# EAGLE design untitled (EAGLE 6.5.0)
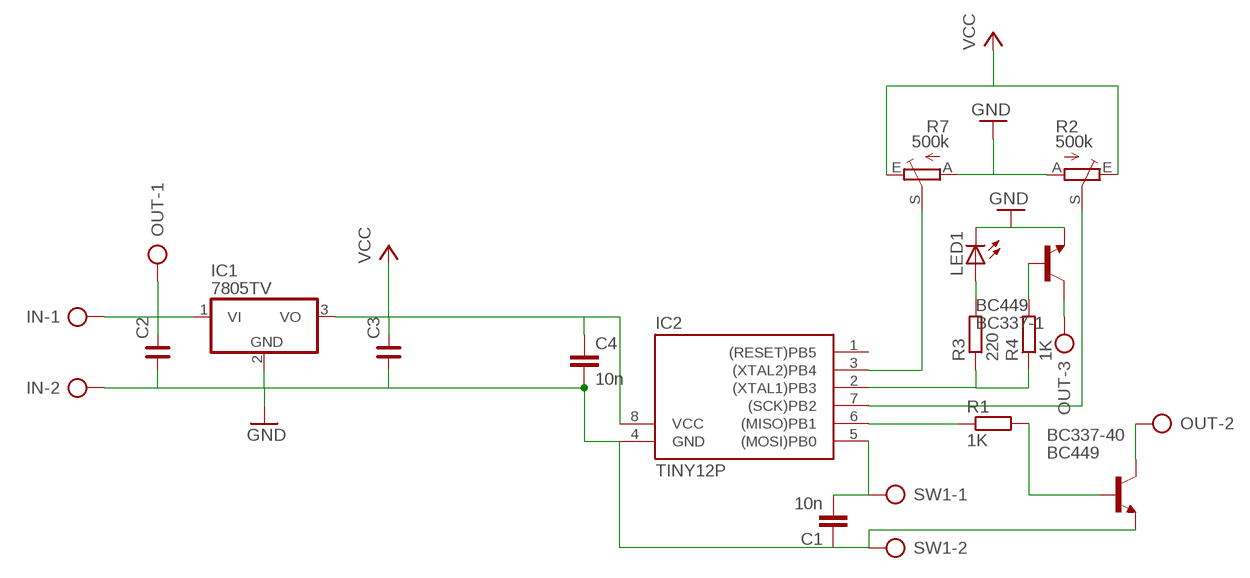
[diagram p0: schematic, sheet 1]

## Parts
BC337-1  BC449  [TO92-EBC]
BC337-40  BC449  [TO92-EBC]
C1  10n  C-EU050-024X044  [C050-024X044]
C2  C_1206  [C1206]
C3  C_1206  [C1206]
C4  10n  C-EU050-024X044  [C050-024X044]
IC1  7805TV  [TO220V]
IC2  TINY12P  [DIL08]
IN  AK500/2  [AK500/2]
LED1  LED3MM  [LED3MM]
OUT  AK500/3  [AK500/3]
R1  1K  R-EU_M1206  [M1206]
R2  500k  TRIM_EU-CA6V  [CA6V]
R3  220  R-EU_M1206  [M1206]
R4  1K  R-EU_M1206  [M1206]
R7  500k  TRIM_EU-CA6V  [CA6V]
SW1  AK500/2  [AK500/2]

## Nets
GND: BC337-1.E BC337-40.E C1.1 C2.1 C3.1 C4.2 IC1.2(GND) IC2.4(GND) IN.2 LED1.K(C) R2.A R7.A SW1.2
N$1: BC337-1.B R4.2
N$2: C2.2 IC1.1(VI) IN.1 OUT.1
N$3: BC337-40.C OUT.2
N$4: C1.2 IC2.5((MOSI)PB0) SW1.1
N$5: BC337-1.C OUT.3
N$6: IC2.6((MISO)PB1) R1.1
N$7: BC337-40.B R1.2
N$10: IC2.7((SCK)PB2) R2.S
N$11: IC2.3((XTAL2)PB4) R7.S
N$13: LED1.A R3.2
N$14: IC2.2((XTAL1)PB3) R3.1 R4.1
VCC: C3.2 C4.1 IC1.3(VO) IC2.8(VCC) R2.E R7.E
Unconnected: IC2.1((RESET)PB5)

## Library data of the parts
BC337-1 BC337-40 = transistor-npn:BC449*: NPN Transistor
C1 C4 = rcl:C-EU: CAPACITOR, European symbol
C2 C3 = rc-master:C_: NON-POLARIZED CAP
IC1 = linear:78*: Positive VOLTAGE REGULATOR Source: http://cache.national.com/ds/LM/LM78L05.pdf http://www.fairchildsemi.com/ds/LM/LM7805.pdf
IC2 = atmel:TINY12*: MICROCONTROLLER 1 Kbytes FLASH 64 bytes EEPROM; OC_FARNELL: unknown; OC_NEWARK: unknown
IN SW1 = con-ptr500:AK500/2: CONNECTOR; OC_FARNELL: unknown; OC_NEWARK: unknown
LED1 = led:LED: LED OSRAM: - CHIPLED LG R971, LG N971, LY N971, LG Q971, LY Q971, LO R971, LY R971 LH N974, LH R974 LS Q976, LO Q976, LY Q976 LO Q996 - Hyper CHIPLED LW Q18S LB Q993, LB Q99A, LB R99A - SideLED LS A670, LO A670, LY A670, LG A670, LP A670 LB A673, LV A673, LT A673, LW A673 LH A674 LY A675 LS A676, LA A676, LO A676, LY A676, LW A676 LS A679, LY A679, LG A679 - Hyper Micro SIDELED® LS Y876, LA Y876, LO Y876, LY Y876 LT Y87S - SmartLED LW L88C, LW L88S LB L89C, LB L89S, LG L890 LS L89K, LO L89K, LY L89K LS L896, LA L896, LO L896, LY L896 - TOPLED LS T670, LO T670, LY T670, LG T670, LP T670 LSG T670, LSP T670, LSY T670, LOP T670, LYG T670 LG T671, LOG T671, LSG T671 LB T673, LV T673, LT T673, LW T673 LH T674 LS T676, LA T676, LO T676, LY T676, LB T676, LH T676, LSB T676, LW T676 LB T67C, LV T67C, LT T67C, LS T67K, LO T67K, LY T67K, LW E67C LS E67B, LA E67B, LO E67B, LY E67B, LB E67C, LV E67C, LT E67C LW T67C LS T679, LY T679, LG T679 LS T770, LO T770, LY T770, LG T770, LP T770 LB T773, LV T773, LT T773, LW T773 LH T774 LS E675, LA E675, LY E675, LS T675 LS T776, LA T776, LO T776, LY T776, LB T776 LHGB T686 LT T68C, LB T68C - Hyper Mini TOPLED® LB M676 - Mini TOPLED Santana® LG M470 LS M47K, LO M47K, LY M47K Source: http://www.osram.convergy.de LUXEON: - LUMILED® LXK2-PW12-R00, LXK2-PW12-S00, LXK2-PW14-U00, LXK2-PW14-V00 LXK2-PM12-R00, LXK2-PM12-S00, LXK2-PM14-U00 LXK2-PE12-Q00, LXK2-PE12-R00, LXK2-PE12-S00, LXK2-PE14-T00, LXK2-PE14-U00 LXK2-PB12-K00, LXK2-PB12-L00, LXK2-PB12-M00, LXK2-PB14-N00, LXK2-PB14-P00, LXK2-PB14-Q00 LXK2-PR12-L00, LXK2-PR12-M00, LXK2-PR14-Q00, LXK2-PR14-R00 LXK2-PD12-Q00, LXK2-PD12-R00, LXK2-PD12-S00 LXK2-PH12-R00, LXK2-PH12-S00 LXK2-PL12-P00, LXK2-PL12-Q00, LXK2-PL12-R00 Source: www.luxeon.com KINGBRIGHT: KA-3528ASYC Source: www.kingbright.com
OUT = con-ptr500:AK500/3: CONNECTOR; OC_FARNELL: unknown; OC_NEWARK: unknown
R1 R3 R4 = resistor:R-EU_: RESISTOR, European symbol
R2 R7 = pot:TRIM_EU-: POTENTIOMETER

## Board
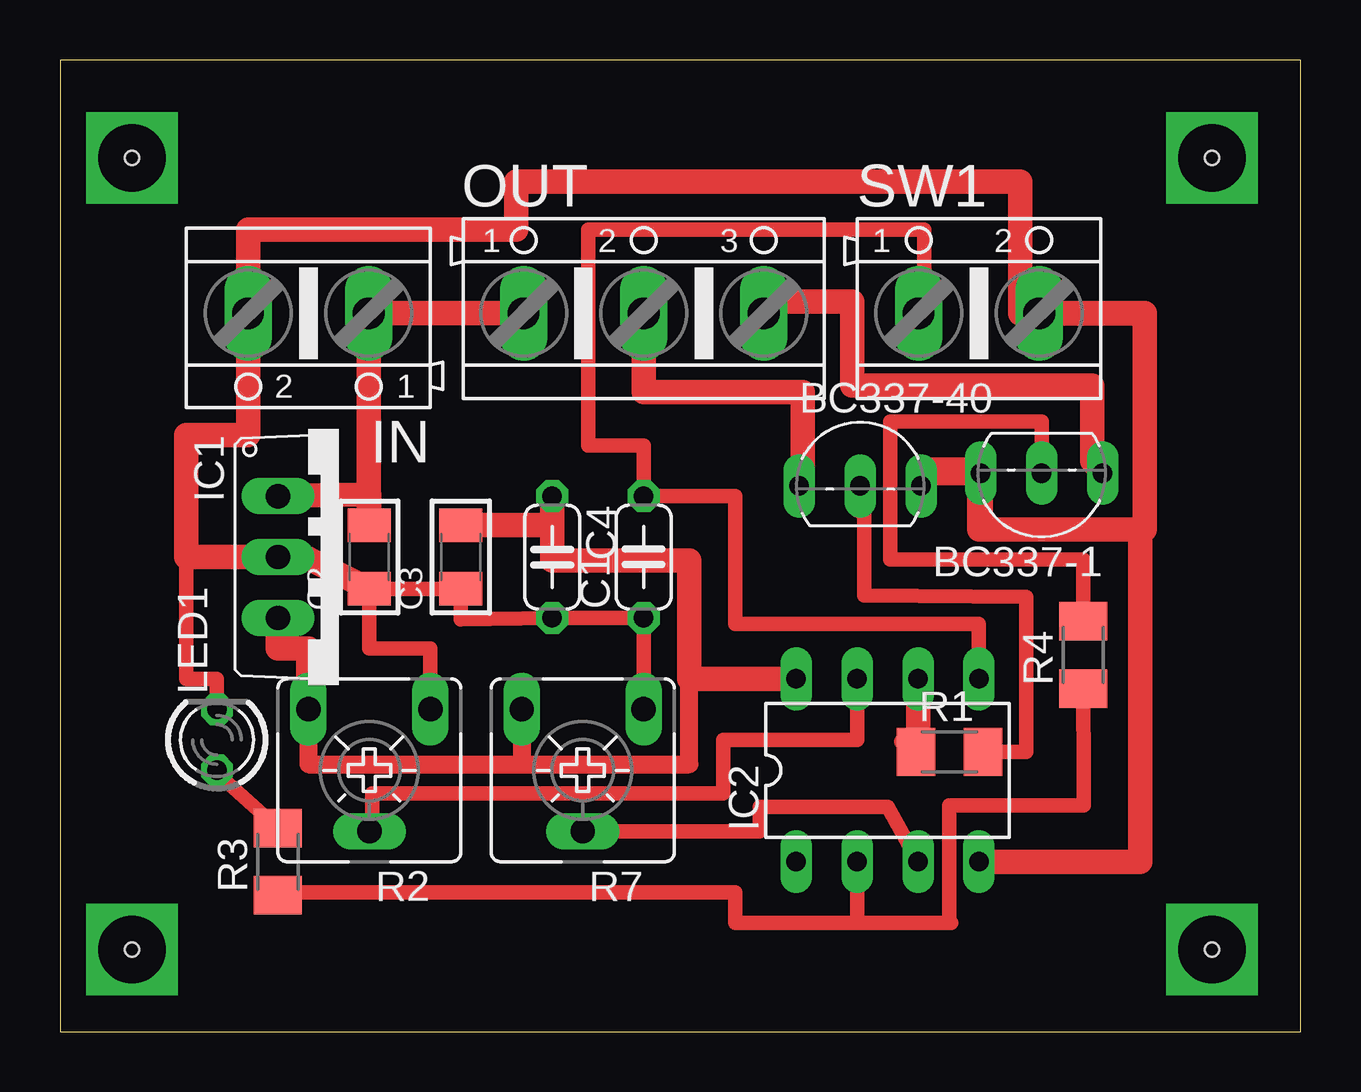
[diagram p1: board, top side]

Size 51.7 x 40.5 mm. Coordinates in mm from the lower left corner, seen from the top.
Outline: 0,0 51.7,0 51.7,40.5 0,40.5 0,0
Copper layers (1*16): Top 0.035mm / dielectric 1.5mm / Bottom 0.035mm
Design rules "default *": minimum track width 10mil, minimum drill 24mil, track to track 12mil, track to pad 12mil, pad to pad 8mil, via to via 8mil, smd to smd 8mil, copper to edge 40mil, drill to drill 8mil, minimum pad ring 10mil, minimum via ring 8mil, stop-mask expansion 4mil, vias tented up to drill 0mil, thermal gap 10mil
Holes 0.6 mm at 3,3.42 48,3.42 48,36.42 3,36.42

### Footprints (pad centres in the part's own frame; a part is rotated, then mirrored left to right if it is on the bottom)
TO92-EBC = drill 0.813 long: B 0,-1.27; C -2.54,-1.27; E 2.54,-1.27
C050-024X044 = drill 0.813 octagon: 1 -2.54,0; 2 2.54,0
C1206 = smd 1.4 x 1.8: 1 -1.329,0; 2 1.329,0
TO220V = drill 1.016 long: 1 -2.54,-2.54; 2 0,-2.54; 3 2.54,-2.54
DIL08 = drill 0.813 long: 1 -3.81,-3.81; 2 -1.27,-3.81; 3 1.27,-3.81; 4 3.81,-3.81; 5 3.81,3.81; 6 1.27,3.81; 7 -1.27,3.81; 8 -3.81,3.81
AK500/2 = drill 1.321 long: 1 -2.515,0; 2 2.515,0
LED3MM = drill 0.813 octagon: A -1.27,0; K 1.27,0
AK500/3 = drill 1.321 long: 1 -5.004,0; 2 0,0; 3 5.004,0
M1206 = smd 1.6 x 2: 1 -1.4,0; 2 1.4,0
CA6V = drill 1.016 long: A -2.54,-2.54; E 2.54,-2.54; S 0,2.54

### Placement (x,y rotation side)
BC337-1  40.9,22.01 180 top
BC337-40  33.34,24.01 0 top
C1  24.32,19.78 90 top
C2  12.89,19.78 90 top
C3  16.7,19.78 90 top
C4  20.51,19.78 270 top
IC1  11.62,19.78 270 top
IC2  34.48,10.89 0 top
IN  10.35,29.94 180 top
LED1  6.54,12.16 90 top
OUT  24.32,29.94 0 top
R1  37.06,11.66 0 top
R2  12.89,10.89 180 top
R3  9.08,7.08 90 top
R4  42.64,15.7 90 top
R7  21.78,10.89 180 top
SW1  38.29,29.94 0 top

### Tracks (layer width: path | path; a pad name or v marks a point on that pad's centre or on a via)
GND
  Top 0.61: R7.A C1.1 C4.2 16.7,17.18 C3.1 C2.1 12.89,15.97 15.43,15.97 R2.A | LED1.K 6.54,14.7 5.27,14.7 5.27,19.78
  Top 1.016: C2.1 10.35,19.72 IC1.2 5.27,19.78 5.27,24.86 7.83,24.86 IN.2 7.83,33.42 19,33.42 19,35.42 40,35.42 40,29.92 45.2,29.92 | 38.36,20.92 BC337-1.E 35.88,23.28 BC337-40.E 36,22.74 36,23.42 38.3,23.42 38.3,20.92 38.36,20.92 | 38.36,20.92 45,20.92 | 45,20.92 45.2,20.92 45.2,29.92 | 45.2,29.92 45.2,29.94 SW1.2 | IC2.4 45,7.08 45,20.92
N$1
  Top 0.61: BC337-1.B 40.9,25.42 34.6,25.42 34.6,19.67 42.64,19.67 R4.2
N$2
  Top 1.016: IC1.1 12.89,22.38 C2.2 12.87,21.11 IN.1 OUT.1
N$3
  Top 1.016: 24.25,29.94 OUT.2 24.32,26.65 30.94,26.65 30.94,22.59 30.79,22.59 BC337-40.C
N$4
  Top 0.61: IC2.5 38.29,16.99 28.13,16.99 28.13,22.32 C1.2 24.32,24.42 22,24.42 22,33.42 36,33.42 36,29.94
  Top 1.016: SW1.1 36,29.94
N$5
  Top 1.016: OUT.3 29.32,30.42 33,30.42 33,26.92 43,26.92 43,23.78 BC337-1.C
N$6
  Top 0.61: 35.75,12.1 35.06,12.09 35.06,12.07 R1.1
  Top 1.016: IC2.6 35.75,12.1
N$7
  Top 0.61: 33.33,21.9 33.5,21.9 33.5,18.17 40.25,18.11 40.25,11.66 R1.2
  Top 1.016: BC337-40.B 33.33,21.9
N$8  (via drill 2.8 pad 1.93)
  other vias: 3,36.42 3,3.42 48,3.42 48,36.42
N$10
  Top 0.61: IC2.7 33.21,12.16 27.63,12.16 27.63,9.92 13,9.92 13,8.35
  Top 1.016: 13,8.35 R2.S
N$11
  Top 0.61: IC2.3 34.48,9.37 29.15,9.37 29.15,8.35 R7.S
N$13
  Top 0.61: R3.2 6.41,10.89
  Top 1.016: 6.41,10.89 LED1.A
N$14
  Top 0.61: 9.08,5.81 28.13,5.81 28.13,4.54 33.21,4.54 | 33.21,4.54 IC2.2 | R4.1 42.65,10.67 42.65,9.42 37.05,9.42 37.05,4.54 | 37.05,4.54 37.14,4.54 | 37.05,4.54 33.21,4.54
  Top 1.016: R3.1 9.08,5.81
VCC
  Top 0.75: R7.E 19.24,11.14 | 19.24,11.14 26.23,11.14 26.23,14.7 | R2.E 10.35,11.14 19.24,11.14
  Top 1.016: C3.2 20.51,21.11 C4.1 20.51,19.64 26.23,19.64 26.23,14.7 IC2.8 | R2.E 10.35,15.97 9.08,15.97 IC1.3